# Altium schematic sheet 集成运算放大器的应用.SchDoc
size A3
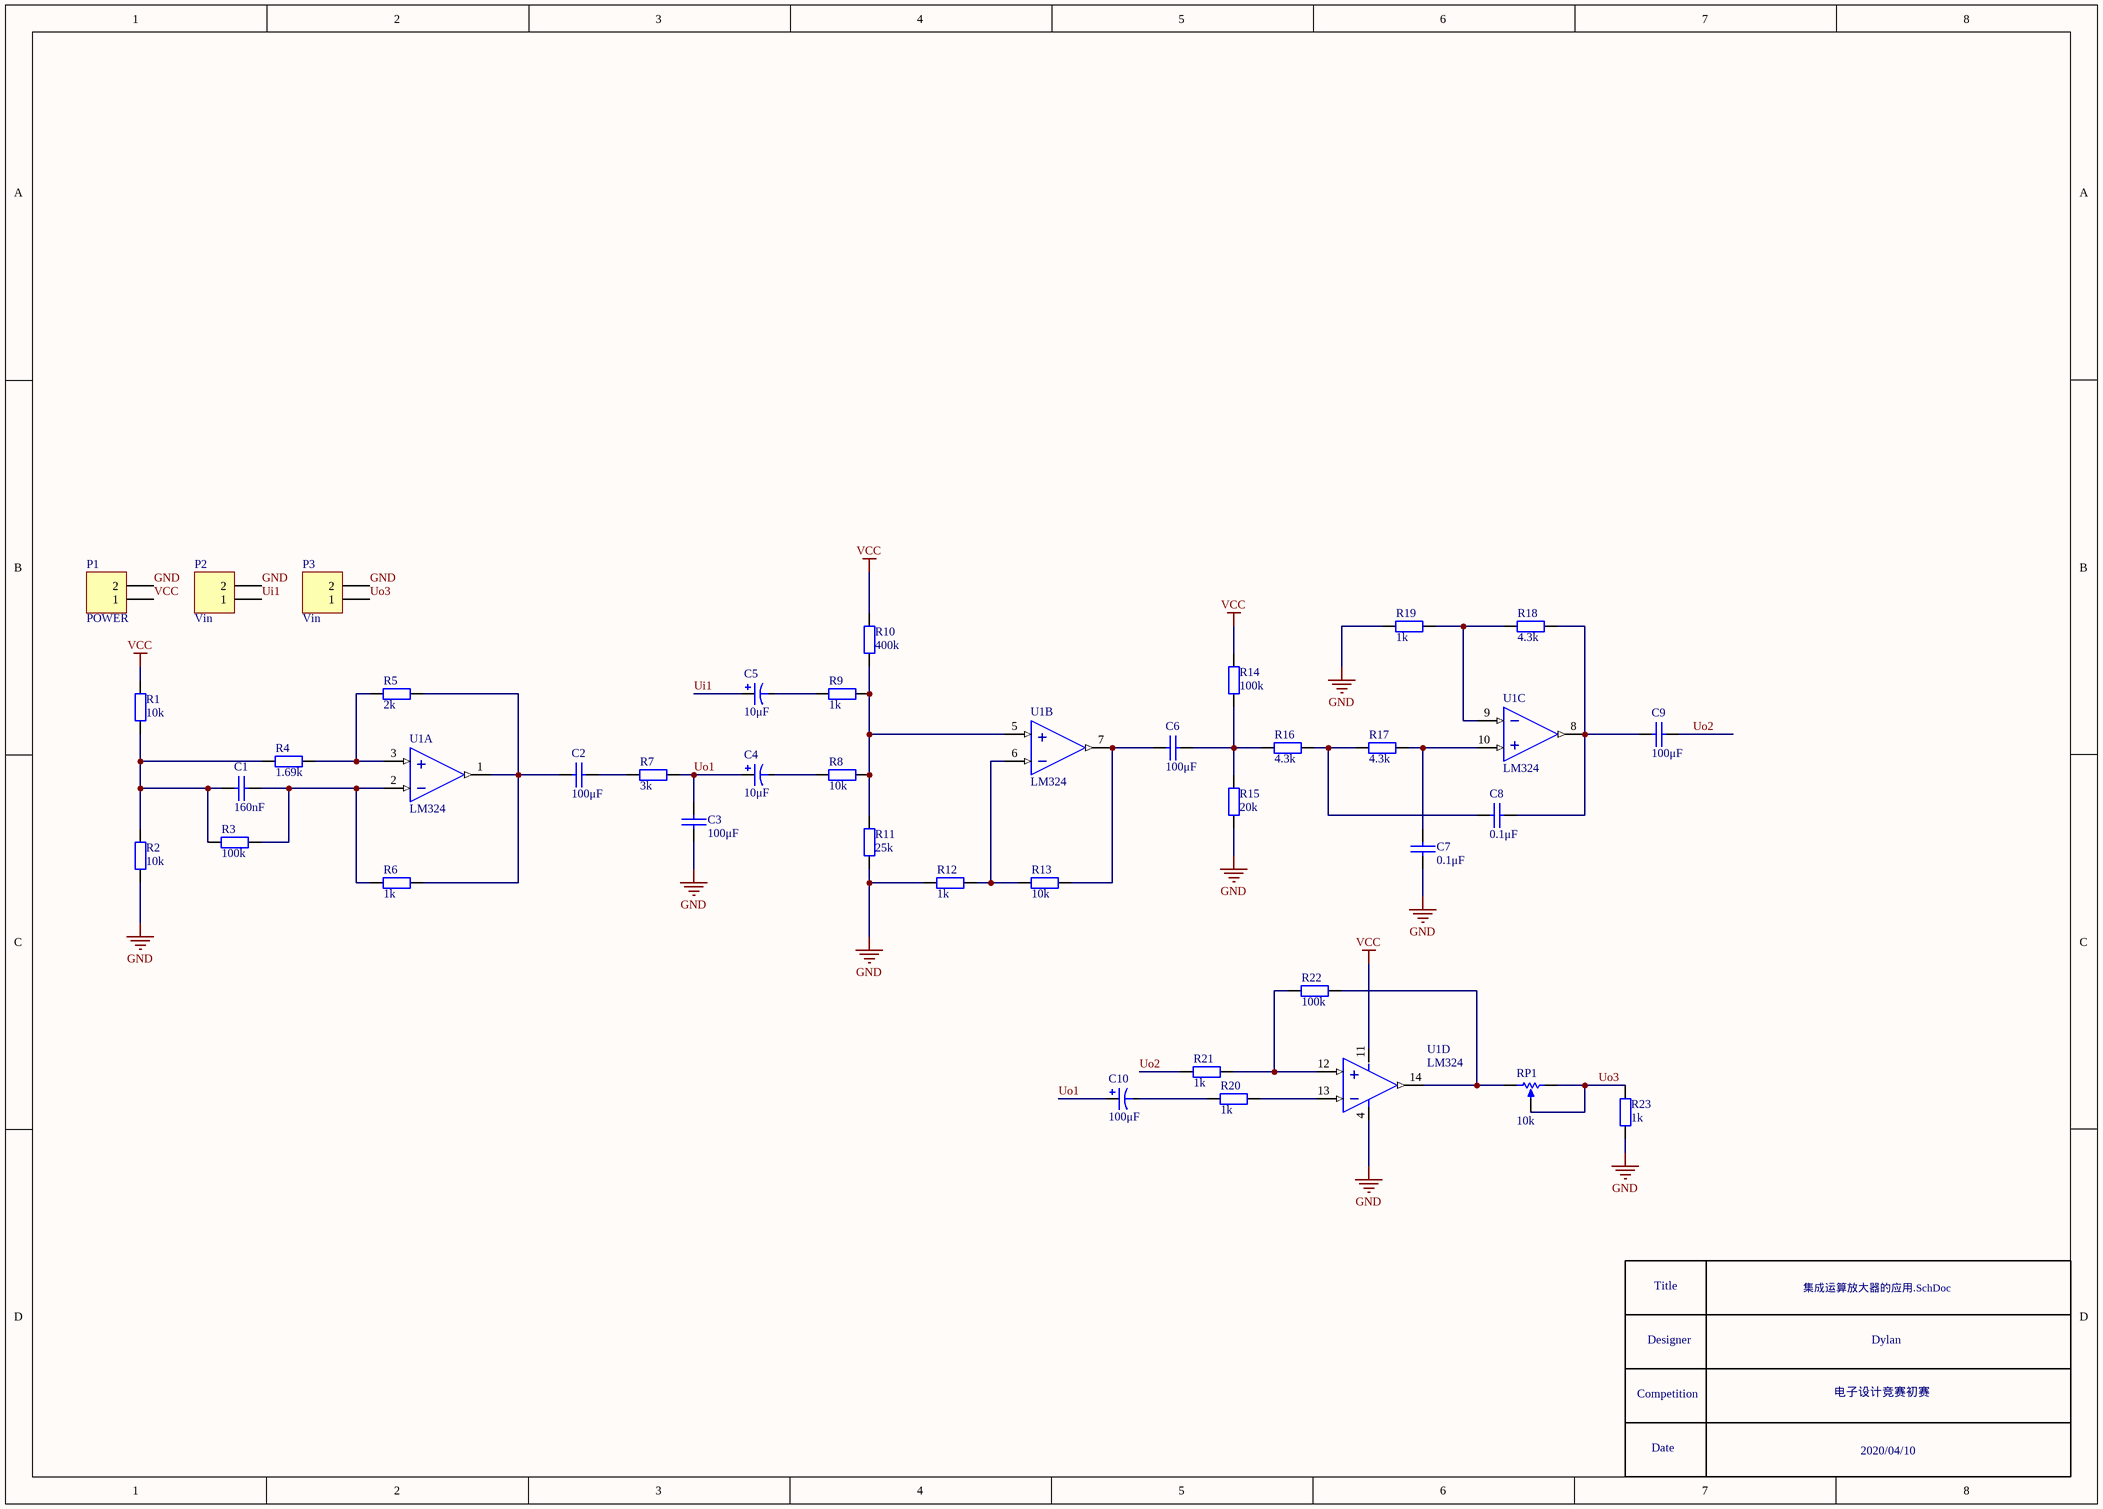
[diagram p0: 集成运算放大器的应用.SchDoc]

## Parts
C1  160nF  [0805C]
C2  100μF  [0805C]
C3  100μF  [0805C]
C4  10μF  [CAP.1/.2]
C5  10μF  [CAP.1/.2]
C6  100μF  [0805C]
C7  0.1μF  [0805C]
C8  0.1μF  [0805C]
C9  100μF  [0805C]
C10  100μF  [CAP.1/.2]
P1  POWER  [HDR1X2]
P2  Vin  [HDR1X2]
P3  Vin  [HDR1X2]
R1  10k  [0805R]
R2  10k  [0805R]
R3  100k  [0805R]
R4  1.69k  [0805R]
R5  2k  [0805R]
R6  1k  [0805R]
R7  3k  [0805R]
R8  10k  [0805R]
R9  1k  [0805R]
R10  400k  [0805R]
R11  25k  [0805R]
R12  1k  [0805R]
R13  10k  [0805R]
R14  100k  [0805R]
R15  20k  [0805R]
R16  4.3k  [0805R]
R17  4.3k  [0805R]
R18  4.3k  [0805R]
R19  1k  [0805R]
R20  1k  [0805R]
R21  1k  [0805R]
R22  100k  [0805R]
R23  1k  [0805R]
RP1  10k  [3296]
U1  LM324  [SO-14]  (parts A,B,C,D of 4)

## Nets
GND: C3.1 C7.1 P1.2 P2.2 P3.2 R2.1 R11.1 R12.2 R15.1 R19.2 R23.2 U1.4(VCC)
VCC: P1.1 R1.2 R10.2 R14.2 U1.11(GND)
Ui1: C5.1 P2.1
Uo1: C3.2 C4.1 C10.1 R7.2
Uo2: C9.2 R21.2
Uo3: P3.1 R23.1 RP1.2(BOT) RP1.3(TAP)
NetC1_1: C1.1 R1.1 R2.2 R3.1 R4.1
NetC1_2: C1.2 R3.2 R6.1 U1.2(1IN-)
NetC2_1: C2.1 R5.2 R6.2 U1.1(OUT1)
NetC2_2: C2.2 R7.1
NetC4_2: C4.2 R8.2
NetC5_2: C5.2 R9.2
NetC6_1: C6.1 R13.1 U1.7(2OUT)
NetC6_2: C6.2 R14.1 R15.2 R16.2
NetC7_2: C7.2 R17.1 U1.10(3N+)
NetC8_1: C8.1 R16.1 R17.2
NetC8_2: C8.2 C9.1 R18.1 U1.8(3OUT)
NetC10_2: C10.2 R20.2
NetR4_2: R4.2 R5.1 U1.3(1IN+)
NetR8_1: R8.1 R9.1 R10.1 R11.2 U1.5(2IN+)
NetR12_1: R12.1 R13.2 U1.6(2IN-)
NetR18_2: R18.2 R19.1 U1.9(3N-)
NetR20_1: R20.1 U1.13(4IN-)
NetR21_1: R21.1 R22.2 U1.12(4IN+)
NetR22_1: R22.1 RP1.1(TOP) U1.14(4OUT)

## Notes on the sheet
- Title
- 集成运算放大器的应用.SchDoc
- Competition
- Designer
- 电子设计竞赛初赛
- Dylan
- Date
- 2020/04/10

## Library data of the parts
C1-C3 C6-C9 = CAP: Capacitor
C4 C5 C10 = CAP+: Capacitor
P1-P3 = Header 2: Header, 2-Pin; LatestRevisionDate: 17-Jul-2002; LatestRevisionNote: Re-released for DXP Platform.; Publisher: Altium Limited
R1-R23 = Res: Resistor
RP1 = RPOT1: Resistor